# Altium schematic sheet 2.4G.SchDoc
size A3; SheetNumber: 3; SheetTotal: 5
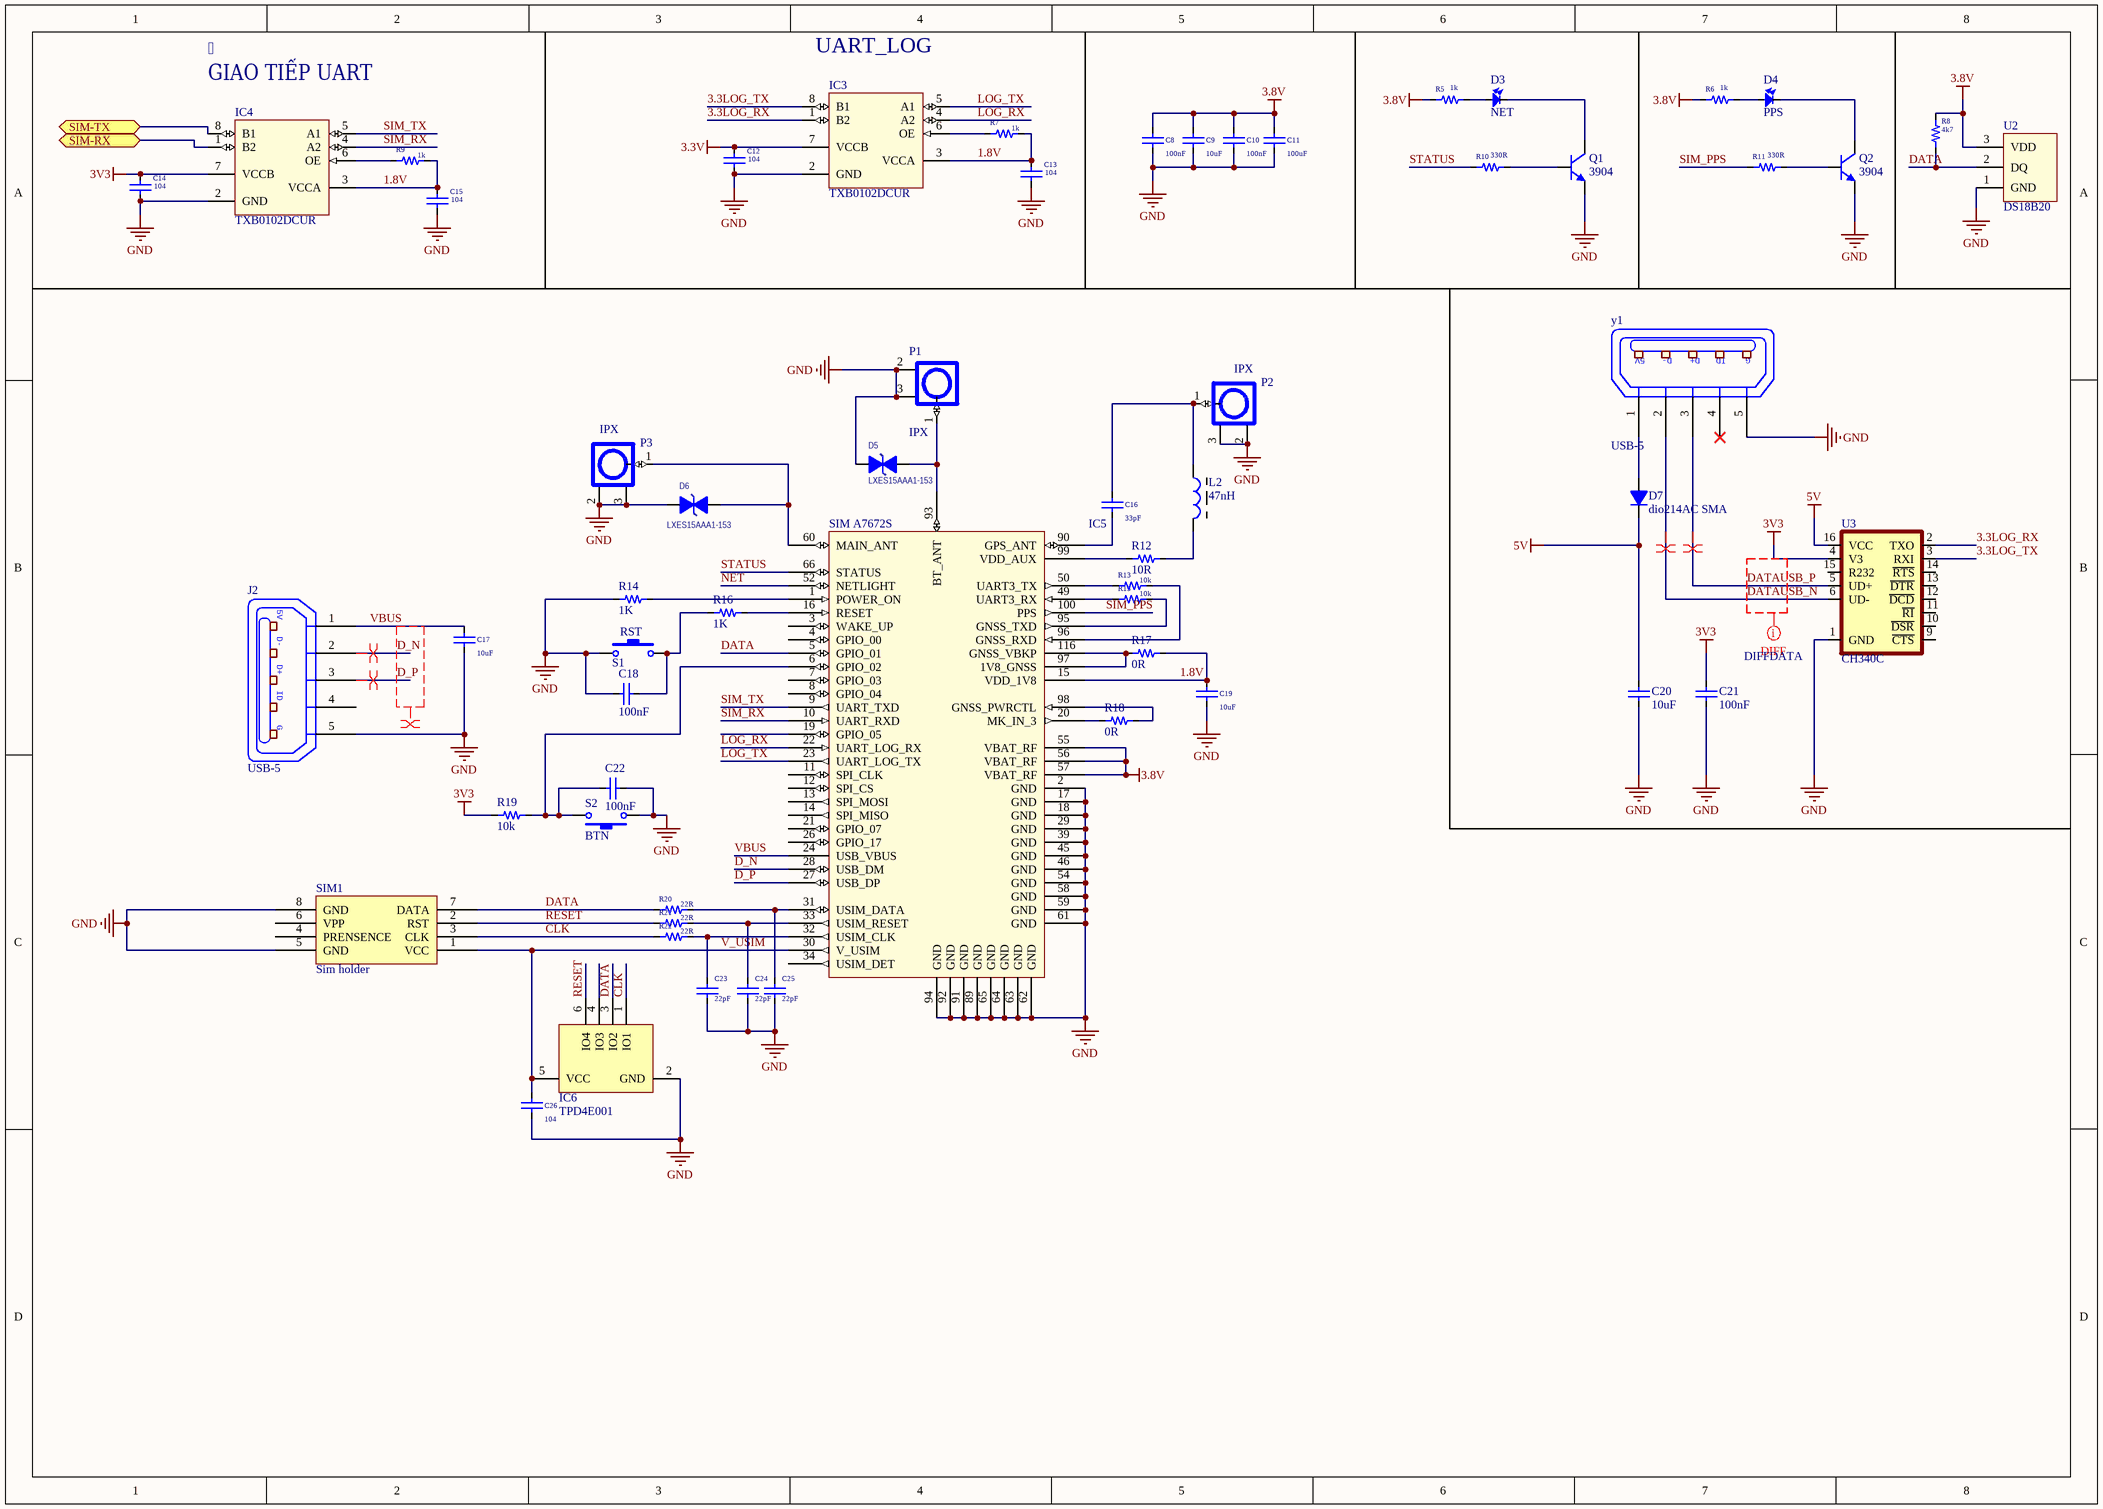
[diagram p0: 2.4G.SchDoc]

## Parts
C8  100nF  [CAP_0805]
C9  10uF  [CAP_0805]
C10  100nF  [CAP_0805]
C11  100uF  [CAP_0805]
C12  104  [CAP_0805]
C13  104  [CAP_0805]
C14  104  [CAP_0805]
C15  104  [CAP_0805]
C16  33pF  [CAP_0805]
C17  10uF  [CAP_0603]
C18  100nF  [CAP_0805]
C19  10uF  [CAP_0805]
C20  10uF  [CAP_0805]
C21  100nF  [CAP_0402]
C22  100nF  [CAP_0805]
C23  22pF  [CAP_0805]
C24  22pF  [CAP_0805]
C25  22pF  [CAP_0805]
C26  104  [CAP_0805]
D3  NET  [LED-0805-Blue]
D4  PPS  [LED-0805-Blue]
D5  LXES15AAA1-153  [INDC1005X45]
D6  LXES15AAA1-153  [INDC1005X45]
D7  dio214AC SMA  [DIO-SMD-106]
IC3  TXB0102DCUR  [SOP50P310X90-8N]
IC4  TXB0102DCUR  [SOP50P310X90-8N]
IC5  SIM A7672S  [A7672S]
IC6  TPD4E001  [SOT23-6]
J2  USB-5  [USB-M1]
L2  47nH  [Inductor_SMD]
P1  IPX  [IPXS]
P2  IPX  [IPXS]
P3  IPX  [IPXS]
Q1  3904  [MMBT3904]
Q2  3904  [MMBT3904]
R5  1k  [RES-SMD-0805]
R6  1k  [RES-SMD-0805]
R7  1k  [RES-SMD-0805]
R8  4k7  [RES-SMD-0805]
R9  1k  [RES-SMD-0805]
R10  330R  [RES-SMD-0805]
R11  330R  [RES-SMD-0805]
R12  10R  [RES-SMD-0805]
R13  10k  [RES-SMD-0805]
R14  1K  [RES-SMD-0805]
R15  10k  [RES-SMD-0805]
R16  1K  [RES-SMD-0805]
R17  0R  [RES-SMD-0805]
R18  0R  [RES-SMD-0805]
R19  10k  [RES-SMD-0805]
R20  22R  [RES-SMD-0805]
R21  22R  [RES-SMD-0805]
R22  22R  [RES-SMD-0805]
S1  RST  [SW-SMD]
S2  BTN  [SW-SMD]
SIM1  Sim holder  [SIM_MicroSIM 6P Flip]
U2  DS18B20  [QTO-92A]
U3  CH340C  [SOP-16]
y1  USB-5  [USB-M1]

## Ports
SIM-RX (bidir), SIM-TX (bidir)

## Nets
3.3V: C12.2 IC3.7(VCCB)
3.8V: C8.2 C9.2 C10.2 C11.2 IC5.55(VBAT_RF) IC5.56(VBAT_RF) IC5.57(VBAT_RF) R5.2 R6.2 R8.1 U2.3(VDD)
3V3: C14.2 C21.1 IC4.7(VCCB) R19.1 U3.4(V3)
5V: C20.1 D7.2(K) U3.16(VCC)
GND: C8.1 C9.1 C10.1 C11.1 C12.1 C13.1 C14.1 C15.1 C17.1 C18.1 C19.1 C20.2 C21.2 C22.2 C23.1 C24.1 C25.1 C26.1 D5.2(K) D6.2(K) IC3.2(GND) IC4.2(GND) IC5.2(GND) IC5.17(GND) IC5.18(GND) IC5.29(KEYPAD_0) IC5.39(GND) IC5.45(GND) IC5.46(ADC2) IC5.54(GPIO4) IC5.58(GND) IC5.59(GND) IC5.61(GND) IC5.62(GND) IC5.63(GND) IC5.64(GND) IC5.65(GND) IC5.89(GND) IC5.91(GND) IC5.92(GND) IC5.94(GND) IC6.2(GND) J2.5(P5) P1.2 P1.3 P2.2 P2.3 P3.2 P3.3 Q1.2(E) Q2.2(E) R14.1 S1.1 S2.1 SIM1.5(GND) SIM1.8(GND) U2.1(GND) U3.1(GND) y1.5(P5)
1.8V: C13.2 C15.2 C19.2 IC3.3(VCCA) IC4.3(VCCA) IC5.15(RESERVED) R7.1 R9.1 R17.2
3.3LOG_RX: IC3.1(B2) U3.2(TXO)
3.3LOG_TX: IC3.8(B1) U3.3(RXI)
CLK: IC6.1(IO1) R22.2 SIM1.3(CLK)
D_N: IC5.28(KEYSENSE_N0) J2.2(P2)
D_P: IC5.27(KEYSENSE_N1) J2.3(P3)
DATA: IC5.5(GPIO_01) IC6.3(IO2) R8.2 R20.2 SIM1.7(DATA) U2.2(DQ)
DATAUSB_N: U3.6(UD-) y1.2(P2)
DATAUSB_P: U3.5(UD+) y1.3(P3)
LOG_RX: IC3.4(A2) IC5.22(SPK_P)
LOG_TX: IC3.5(A1) IC5.23(MIC1P)
NET: IC5.52(GPIO41)
RESET: IC6.6(IO4) R21.2 SIM1.2(RST)
SIM-RX: IC4.1(B2) ; port SIM-RX
SIM-TX: IC4.8(B1) ; port SIM-TX
SIM_PPS: IC5.100(PPS) R11.2
SIM_RX: IC4.4(A2) IC5.10(UART_RXD)
SIM_TX: IC4.5(A1) IC5.9(UART_TXD)
STATUS: IC5.66(STATUS) R10.2
V_USIM: C26.2 IC5.30(KEYPAD_2) IC6.5(VCC) SIM1.1(VCC)
VBUS: C17.2 IC5.24(MIC1N) J2.1(P1)
NetC16_1: C16.1 IC5.90(GPS_ANT)
NetC16_2: C16.2 L2.1 P2.1
NetC18_2: C18.2 R16.1 S1.2
NetC22_1: C22.1 IC5.6(GPIO_02) R19.2 S2.2
NetC23_2: C23.2 IC5.32(KEYSENSE_N3) R22.1
NetC24_2: C24.2 IC5.33(KEYPAD_1) R21.1
NetC25_2: C25.2 IC5.31(KEYSENSE_N2) R20.1
NetD3_1: D3.1 R5.1
NetD3_2: D3.2 Q1.3(C)
NetD4_1: D4.1 R6.1
NetD4_2: D4.2 Q2.3(C)
NetD5_1: D5.1(A) IC5.93(BT_ANT) P1.1
NetD6_1: D6.1(A) IC5.60(MAIN_ANT) P3.1
NetD7_1: D7.1(A) y1.1(P1)
NetIC3_6: IC3.6(OE) R7.2
NetIC4_6: IC4.6(OE) R9.2
NetIC5_1: IC5.1(POWER_ON) R14.2
NetIC5_16: IC5.16(RESERVED) R16.2
NetIC5_20: IC5.20(MK_IN_3) R18.1
NetIC5_49: IC5.49(GPIO40) R15.2
NetIC5_50: IC5.50(GPIO43) R13.2
NetIC5_95: IC5.95(GNSS_TXD) R15.1
NetIC5_96: IC5.96(GNSS_RXD) R13.1
NetIC5_97: IC5.97(1V8_GNSS) IC5.116(GNSS_VBKP) R17.1
NetIC5_98: IC5.98(GNSS_PWRCTL) R18.2
NetIC5_99: IC5.99(VDD_AUX) R12.1
NetL2_2: L2.2 R12.2
NetQ1_1: Q1.1(B) R10.1
NetQ2_1: Q2.1(B) R11.1

Not connected (* = marked no-connect by the designer): IC5 3(WAKE_UP) 4(GPIO_00) 7(GPIO_03) 8(GPIO_04) 11(SPI_CLK) 12(SPI_CS) 13(SPI_MOSI) 14(SPI_MISO) 19(GPIO_05) 21(SPK_M) 25(EAR1N) 26(EAR1P) 34(KEYPAD_4) 35(KEYPAD_3) 36(KEYSENSE_N4) 47(ADC1) 48(GPIO44) 51(GPIO1) 53(GPIO42) 73(PCM_DOUT) 74(PCM_DIN) 75(PCM_SYNC) 76(PCM_CLK); IC6 4(IO3); J2 4(P4); SIM1 4(PRENSENCE) 6(VPP); U3 9(~{CTS}) 10(~{DSR}) 11(~{RI}) 12(~{DCD}) 13(~{DTR}) 14(~{RTS}) 15(R232); y1 4(P4)*

## Layout directives
net class DIFFDATA: DATAUSB_N, DATAUSB_P
differential pair; net class DIFFDATA: D_N, D_P, DATAUSB_N, DATAUSB_P

## Notes on the sheet
- 
- (near IC4) GIAO TIẾP UART
- (near IC3) UART_LOG
- (in symbol USB-5) 5V; D-; D+; ID; G

## Library data of the parts
C8-C26 = CapSMD: Capacitor; Value: 33p; Published: 8-Jun-2000; LatestRevisionDate: 17-Jul-2002; LatestRevisionNote: Re-released for DXP Platform.; PackageReference: RAD-0.3; Publisher: Altium Limited
D3 D4 = LED: LED Single colour Green and Red; Value: LED 3 ly Single Colour
D5 D6 = TVS: TVS DIODE 4VWM 1005; Manufacturer: Murata Electronics; Value: 4V; Category: Circuit Protection; Package: 0402; Part number: LXES15AAA1-153; User_Description: TVS DIODE 4VWM 1005
D7 = D1A: Diode 1A; Value: 1N4007
IC3 IC4 = TXB0102DCUR: IC TRNSLTR BIDIRECTIONAL US8; Manufacturer: Texas Instruments; Category: IC Logic Level; Package: 8-VSSOP; Part number: TXB0102DCUR; User_Description: IC TRNSLTR BIDIRECTIONAL US8
IC5 = SIM A7672S: SIM A7672S-CAT-M1; Part number: SIM A7672S
IC6 = TPD4E001_1: Manufacturer: Texas Instruments; Part number: TPD4E001RDBVR; User_Description: TVS DIODE 5.5VWM SC70-6; Category: Circuit Protection; Package: SOT-363
J2 y1 = USB-5: Manufacturer: FCI; Category: Connectors, Interconnects
L2 = Inductor Ferit: FIXED IND 47NH 300MA 700MOHM SMD; Manufacturer: Taiyo Yuden; Part number: HK160847NJ-T; Value: 150 mH; Category: INDUCTORS; Package: 0603; User_Description: FIXED IND 47NH 300MA 700MOHM SMD
P1-P3 = IPXSx66: Antenna GSM GPS; Manufacturer: TE Connectivity AMP Connectors; Part number: 2334884-1; User_Description: UMCC MICRO-COAX RECEPTACLE, GEN; Category: Connectors; Package: SMD
Q1 Q2 = MMBT3904
R5-R22 = Resistor - SMD: Resistor; Manufacturer: Generic Components; Class: Passive; Published: 08/06/2000; Publisher: Altium Hobart Technology Centre
S1 S2 = SW-SMD: Switch; Published: 24-Mar-1999; LatestRevisionDate: 17-Jul-2002; LatestRevisionNote: Re-released for DXP Platform.; PackageReference: SPST-2; Publisher: Altium Limited
SIM1 = SIM_MicroSim
U2 = DS18B20: High Precision  1-Wire® Digital Thermometer
U3 = CH340C: USB to serial chip CH340; MF: WCH; Package: Package; Check_prices: https://www.snapeda.com/parts/CH340C/WCH/view-part/5428851/?ref=eda; Value: *; Price: None; MP: CH340C; Availability: Unavailable; SnapEDA_Link: https://www.snapeda.com/parts/CH340C/WCH/view-part/5428851/?ref=snap